# EAGLE schematic Schematic (EAGLE 8.6.0)
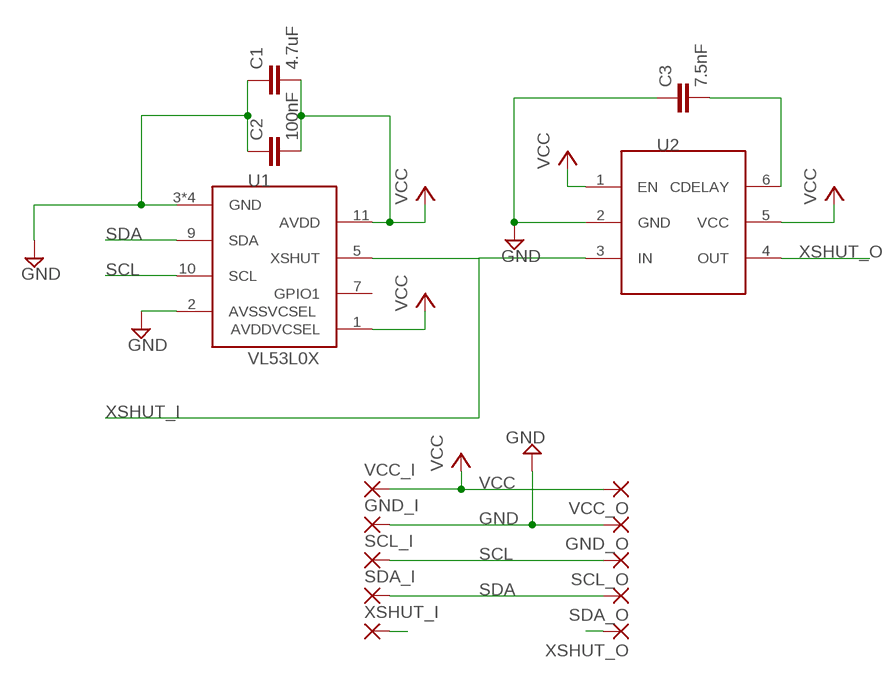
[diagram p0: schematic, sheet 1]

## Parts
C1  4.7uF  4.7UF0603  [0603]
C2  100nF  0.1UF-0603-25V-5%  [0603]
C3  7.5nF  100PF-0402-50V-5%  [0402]
GND_I  SMD2  [SMD1,27-2,54]
GND_O  SMD2  [SMD1,27-2,54]
SCL_I  SMD2  [SMD1,27-2,54]
SCL_O  SMD2  [SMD1,27-2,54]
SDA_I  SMD2  [SMD1,27-2,54]
SDA_O  SMD2  [SMD1,27-2,54]
U1  VL53L0X  [OPTICAL_LGA12]
U2  MAX6895AAZT+T  [6-THIN-SOT23]
VCC_I  SMD2  [SMD1,27-2,54]
VCC_O  SMD2  [SMD1,27-2,54]
XSHUT_I  SMD2  [SMD1,27-2,54]
XSHUT_O  SMD2  [SMD1,27-2,54]

## Nets
CDELAY: C3.2 U2.6(CDELAY)
GND: C1.1 C2.1 C3.1 GND_I.1(P) GND_O.1(P) U1.2(AVSSVCSEL) U1.3(GND) U1.4(GND) U1.6(GND) U1.12(GND) U2.2(GND)
SCL: SCL_I.1(P) SCL_O.1(P) U1.10(SCL)
SDA: SDA_I.1(P) SDA_O.1(P) U1.9(SDA)
VCC: C1.2 C2.2 U1.1(AVDDVCSEL) U1.11(AVDD) U2.1(EN) U2.5(VCC) VCC_I.1(P) VCC_O.1(P)
XSHUT_I: U1.5(XSHUT) U2.3(IN) XSHUT_I.1(P)
XSHUT_O: U2.4(OUT) XSHUT_O.1(P)
Unconnected: U1.7(GPIO1)

## Library data of the parts
C1 = SparkFun-Capacitors:4.7UF: 4.7µF ceramic capacitors A capacitor is a passive two-terminal electrical component used to store electrical energy temporarily in an electric field.; PROD_ID: CAP-08280
C2 = SparkFun-Capacitors:0.1UF: 0.1µF ceramic capacitors A capacitor is a passive two-terminal electrical component used to store electrical energy temporarily in an electric field.; PROD_ID: CAP-08604; VALUE: 0.1uF
C3 = SparkFun-Capacitors:100PF: 100pF/0.1nF ceramic capacitors A capacitor is a passive two-terminal electrical component used to store electrical energy temporarily in an electric field.; PROD_ID: CAP-13458; VALUE: 100PF
GND_I GND_O SCL_I SCL_O SDA_I SDA_O VCC_I VCC_O XSHUT_I XSHUT_O = wirepad:SMD2: SMD PAD
U1 = SeanSylwester:VL53L0X: The VL53L0X is a new generation Time-of-Flight (ToF) laser-ranging module housed in the smallest package on the market today, providing accurate distance measurement whatever the target reflectances unlike conventional technologies. It can measure absolute distances up to 2m, setting a new benchmark in ranging performance levels, opening the door to various new applications. The VL53L0X integrates a leading-edge SPAD array (Single Photon Avalanche Diodes) and embeds ST’s second generation FlightSenseTM patented technology. The VL53L0X’s 940nm VCSEL emitter (Vertical Cavity Surface-Emitting Laser), is totally invisible to the human eye, coupled with internal physical infrared filters, it enables longer ranging distance, higher immunity to ambient light and better robustness to cover-glass optical cross-talk.
U2 = SeanSylwester:MAX6895AAZT+T: The MAX6895–MAX6899 is a family of small, low-power, voltage-monitoring circuits with sequencing capability. These miniature devices offer tremendous flexibility with an adjustable threshold capable of monitoring down to 0.5V and an external capacitor-adjustable time delay. These devices are ideal for use in power-supply sequencing, reset sequencing, and power-switching applications. Multiple devices can be cascaded for complex sequencing applications. A high-impedance input with a 0.5V threshold allows an external resistive divider to set the monitored threshold. The output asserts (OUT = high or OUT = low) when the input voltage rises above the 0.5V threshold and the enable input is asserted (ENABLE = high or ENABLE = low). When the voltage at the input falls below 0.5V or when the enable input is deasserted (ENABLE = low or ENABLE = high), the output deasserts (OUT = low or OUT = high). All devices provide a capacitor-programmable delay time from when the input rises above 0.5V to when the output is asserted. The MAX689_A versions provide the same capacitor-adjustable delay from when enable is asserted to when the output asserts. The MAX689_P devices have a 1µs propagation delay from when enable is asserted to when the output asserts. The MAX6895A/P offers an active-high enable input and an active-high push-pull output. The MAX6896A/P offers an active-low enable input and an active-low push-pull output. The MAX6897A/P offers an activehigh enable input and an active-high open-drain out-put. Finally, the MAX6898A/P offers an active-low enable input and an active-low open-drain output. The MAX6899A/P offers an active-low enable with an activehigh push-pull output. All devices operate from a 1.5V to 5.5V supply voltage and are fully specified over the -40°C to +125°C operating temperature range. These devices are available in ultra-small 6-pin µDFN (1.0mm x 1.5mm) and thin SOT23 (1.60mm x 2.90mm) packages.

## Net classes
0 default: clearance 0.205 mm